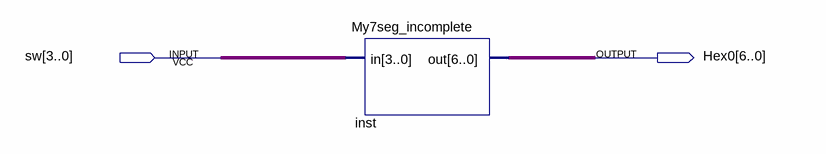
[diagram p0: schematic sheet]
// Quartus schematic My7seg.bdf as structural Verilog: 1 symbols, 2 pins
module My7seg (
  input  [3:0] sw,
  output [6:0] Hex0
);

  My7seg_incomplete inst (.in(sw), .out(Hex0));
endmodule
